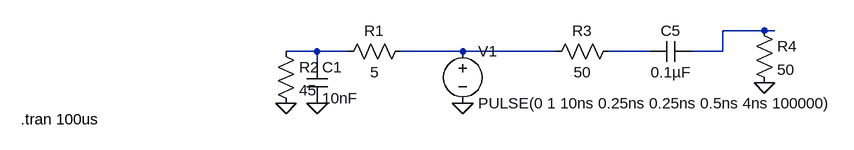
[diagram p0: schematic lpf_on_output.asc]
lpf_on_output.asc, the LTspice schematic file:
Version 4
SHEET 1 880 680
WIRE 512 96 448 96
WIRE 528 96 512 96
WIRE -176 128 -224 128
WIRE -128 128 -176 128
WIRE 48 128 -48 128
WIRE 192 128 48 128
WIRE 336 128 272 128
WIRE 448 128 448 96
WIRE 448 128 400 128
WIRE -176 144 -176 128
FLAG -176 208 0
FLAG 48 208 0
FLAG -224 208 0
FLAG 512 176 0
SYMBOL voltage 48 112 R0
WINDOW 123 0 0 Left 0
WINDOW 39 0 0 Left 0
SYMATTR InstName V1
SYMATTR Value PULSE(0 1 10ns 0.25ns 0.25ns 0.5ns 4ns 100000)
SYMBOL res -32 112 R90
WINDOW 0 0 56 VBottom 2
WINDOW 3 32 56 VTop 2
SYMATTR InstName R1
SYMATTR Value 5
SYMBOL cap -192 144 R0
SYMATTR InstName C1
SYMATTR Value 10nF
SYMBOL res -240 112 R0
SYMATTR InstName R2
SYMATTR Value 45
SYMBOL res 288 112 R90
WINDOW 0 0 56 VBottom 2
WINDOW 3 32 56 VTop 2
SYMATTR InstName R3
SYMATTR Value 50
SYMBOL cap 400 112 R90
WINDOW 0 0 32 VBottom 2
WINDOW 3 32 32 VTop 2
SYMATTR InstName C5
SYMATTR Value 0.1µF
SYMBOL res 496 80 R0
SYMATTR InstName R4
SYMATTR Value 50
TEXT -632 232 Left 2 !.tran 100us

The netlist it stands for:
* lpf_on_output.asc
V1 N003 0 PULSE(0 1 10ns 0.25ns 0.25ns 0.5ns 4ns 100000)
R1 N003 N002 5
C1 N002 0 10nF
R2 N002 0 45
R3 N004 N003 50
C5 N001 N004 0.1µF
R4 N001 0 50
.tran 100us
.backanno
.end